# Altium schematic sheet Voltage Source.SchDoc: Voltage Source
size A4; Author: DODANHLUONG; Revision: 1.0; SheetNumber: 3; SheetTotal: 5; ProjectTitle: DSP_VERSION_1.0
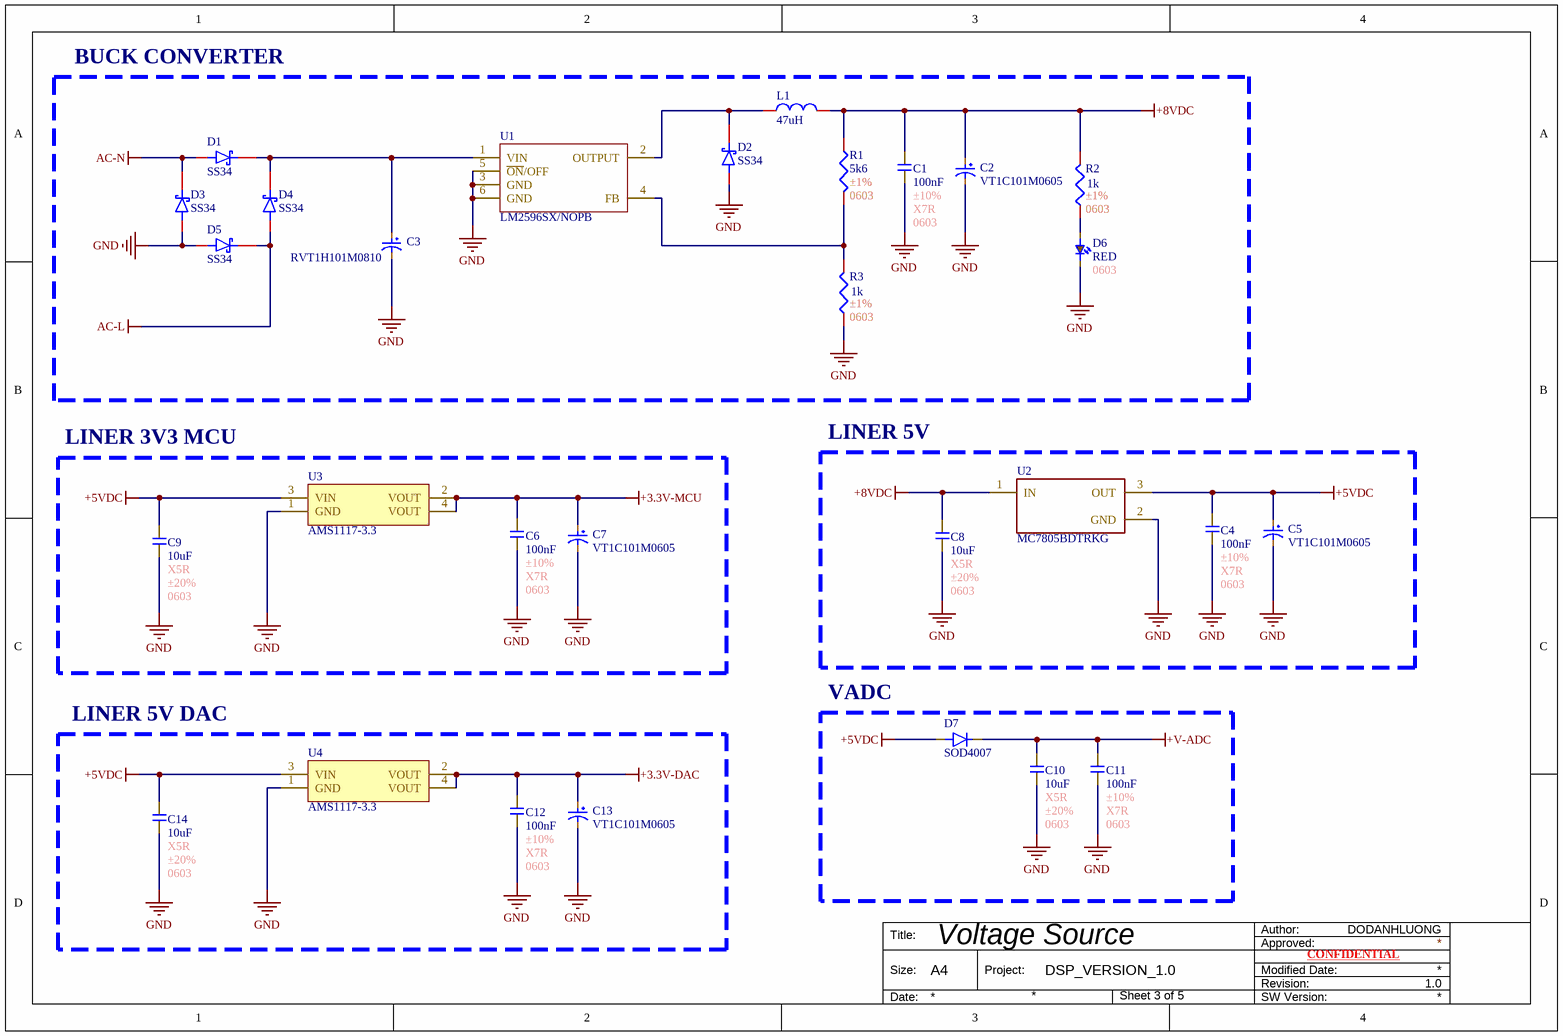
[diagram p0: Voltage Source.SchDoc]

## Parts
C1  100nF  Tolerance: ±10%  Temperature Coefficient: X7R  Package: 0603  [C0603]
C2  VT1C101M0605  [C_100uF_16V_Aluminum]
C3  RVT1H101M0810  [C_100uF_Aluminum]
C4  100nF  Tolerance: ±10%  Temperature Coefficient: X7R  Package: 0603  [C0603]
C5  VT1C101M0605  [C_100uF_16V_Aluminum]
C6  100nF  Tolerance: ±10%  Temperature Coefficient: X7R  Package: 0603  [C0603]
C7  VT1C101M0605  [C_100uF_16V_Aluminum]
C8  10uF  Temperature Coefficient: X5R  Tolerance: ±20%  Package: 0603  [C0603]
C9  10uF  Temperature Coefficient: X5R  Tolerance: ±20%  Package: 0603  [C0603]
C10  10uF  Temperature Coefficient: X5R  Tolerance: ±20%  Package: 0603  [C0603]
C11  100nF  Tolerance: ±10%  Temperature Coefficient: X7R  Package: 0603  [C0603]
C12  100nF  Tolerance: ±10%  Temperature Coefficient: X7R  Package: 0603  [C0603]
C13  VT1C101M0605  [C_100uF_16V_Aluminum]
C14  10uF  Temperature Coefficient: X5R  Tolerance: ±20%  Package: 0603  [C0603]
D1  SS34  [SS34]
D2  SS34  [SS34]
D3  SS34  [SS34]
D4  SS34  [SS34]
D5  SS34  [SS34]
D6  RED  Package: 0603  [LED0603]
D7  SOD4007  [SOD4007]
L1  47uH  [CD43]
R1  5k6  Tolerance: ±1%  Package: 0603  [R0603]
R2  1k  Tolerance: ±1%  Package: 0603  [R0603]
R3  1k  Tolerance: ±1%  Package: 0603  [R0603]
U1  LM2596SX/NOPB  [LM2596SX-5.0/NOPB]
U2  MC7805BDTRKG  [7805]
U3  AMS1117-3.3  [AMS1117-3.3]
U4  AMS1117-3.3  [AMS1117-3.3]

## Blocks framed on the sheet
BUCK CONVERTER: C1-C3 D1-D6 L1 R1-R3 U1
LINER 3V3 MCU: C6 C7 C9 U3
LINER 5V: C4 C5 C8 U2
LINER 5V DAC: C12-C14 U4
VADC: C10 C11 D7

## Nets
+3.3V-DAC: C12.2 C13.1 U4.2(VOUT) U4.4(VOUT)
+3.3V-MCU: C6.2 C7.1 U3.2(VOUT) U3.4(VOUT)
+5VDC: C4.2 C5.1 C9.2 C14.2 D7.2(A) U2.3(OUT) U3.3(VIN) U4.3(VIN)
+8VDC: C1.2 C2.1 C8.2 L1.2 R1.1 R2.2 U2.1(IN)
+V-ADC: C10.2 C11.2 D7.1(C)
AC-L: D4.2 D5.1
AC-N: D1.2 D3.1
GND: C1.1 C2.2 C3.2 C4.1 C5.2 C6.1 C7.2 C8.1 C9.1 C10.1 C11.1 C12.1 C13.2 C14.1 D2.2 D3.2 D5.2 D6.1 R3.1 U1.3(GND) U1.5(~{ON}/OFF) U1.6(GND) U2.2(GND) U3.1(GND) U4.1(GND)
NetC3_1: C3.1 D1.1 D4.1 U1.1(VIN)
NetD2_1: D2.1 L1.1 U1.2(OUTPUT)
NetD6_2: D6.2 R2.1
NetR1_2: R1.2 R3.2 U1.4(FB)

## Notes on the sheet
- Author:
- Title:
- Size:
- A4
- Project:
- Approved:
- Revision:
- Modified Date:
- CONFIDENTIAL
- Date:
- SW Version:

## Library data of the parts
C1 C4 C6 C11 C12 = C0603_100nF_±10%_X7R: 50V 100nF X7R ±10% 0603 Multilayer Ceramic Capacitors MLCC - SMD/SMT ROHS; Manufacturer: YAGEO; Mfr. Part #: CC0603KRX7R9BB104; LCSC Part #: C14663; Capacitance: 100nF; Link: https://www.lcsc.com/product-detail/C14663.html?s_z=n_capital%25200603%2520100nf
C2 C5 C7 C13 = C_100uF_16V_aluminum: 100uF 16V ±20% 63mA@120Hz SMD,D6.3xL5.4mm Aluminum Electrolytic Capacitors RoHS; Manufacturer: ROQANG; Key Attributes: CAP ALUM 100uF ±20% 16V SMD; Mfr. Part #: VT1C101M0605; LCSC Part #: C90273; Package: SMD,D6.3xL5.4mm; Link: https://www.lcsc.com/product-detail/C90273.html?s_z=n_capital%2520100uf%2520aluminum
C3 = C_100uF_aluminum: 100uF 50V ±20% 146mA@120Hz SMD,D8xL10.2mm Aluminum Electrolytic Capacitors RoHS; Manufacturer: ROQANG; Key Attributes: CAP ALUM 100uF ±20% 50V SMD; Mfr. Part #: RVT1H101M0810; LCSC Part #: C72480; Package: SMD,D8xL10.2mm; Link: https://www.lcsc.com/product-detail/C72480.html?s_z=n_capital%2520100uf%2520aluminum
C8-C10 C14 = C0603_10uF_±10%_X7R: 25V 10uF X5R ±20% 0603 Multilayer Ceramic Capacitors MLCC - SMD/SMT ROHS; Manufacturer: YAGEO; Mfr. Part #: CC0603MRX5R8BB106; LCSC Part #: C596327; Capacitance: 10uF; Link: https://www.lcsc.com/product-detail/C596327.html?s_z=n_capital%25200603%252010uF%2520yageo
D1-D5 = SS34: 40V Independent 3A 550mV@3A SMA(DO-214AC) Schottky Diodes ROHS; Manufacturer: MDD(Microdiode Semiconductor); Mfr. Part #: SS34; LCSC Part #: C8678; Package: SMA(DO-214AC); Voltage - DC Reverse(Vr): 40V; Current - Rectified: 3A; Link: https://www.lcsc.com/product-detail/C8678.html?s_z=n_SS34
D6 = D0603_RED: 25mcd~40mcd Water Clear -40℃~+85℃ 624nm Red 120° 60mW 0402 LED Indication - Discrete ROHS; Manufacturer: XINGLIGHT; Mfr. Part #: XL-1005UGC; Voltage - Forward(Vf): 3V; LCSC Part #: C965793; Power(Watts): 60mW; Link: https://www.lcsc.com/product-detail/C136765.html?s_z=n_LED%25200402%2520RED; Illumination Color: RED
D7 = SOD4007: 1A Independent 1kV 1.1V@1A SOD-123FL Diodes - General Purpose ROHS; Manufacturer: MDD(Microdiode Semiconductor); Mfr. Part #: SOD4007; Package: SOD-123FL; LCSC Part #: C18124; Link: https://www.lcsc.com/product-detail/C18124.html?s_z=n_SOD4007; Voltage - DC Reverse(Vr): 1kV; Current - Rectified: 1A
L1 = CD4-10UH: 1.15A 10uH Unshielded Inductor ±20% SMD,4x4.5mm Power Inductors ROHS; Manufacturer: ZE; Mfr. Part #: CD43-100M; Key Attributes: FIXED IND 10uH 1.15A 182mΩ SMD,4x4.5mm; DC Resistance(DCR): 182mΩ; LCSC Part #: C18734467; Package: SMD,4x4.5mm; Link: https://www.lcsc.com/product-detail/C18734467.html?s_z=n_CD43%252010uH; Tolerance: ±20%; Current Rating: 1.15A; Inductance: 10uH
R1-R3 = R0603_4k7Ω_±1%: 62.5mW Thick Film Resistor 50V ±1% ±200ppm/℃ 10Ω 0402 Chip Resistor - Surface Mount ROHS; Manufacturer: YAGEO; Mfr. Part #: RC0402FR-0710RL; Resistance: 4k7Ω; LCSC Part #: C138066; Link: https://www.lcsc.com/product-detail/C138066.html?s_z=n_resistor%25200402%252010R
U1 = LM2596SX/NOPB: 150kHz Buck Fixed 1 TO-263-5 Voltage Regulators - DC DC Switching Regulators RoHS; Manufacturer: TI; Key Attributes: LM2596 SIMPLE SWITCHER 3A Step-Down Voltage Regulator; Mfr. Part #: LM2596SX/NOPB; LCSC Part #: C10002; Package: TO-263-5; Link: https://www.lcsc.com/product-detail/C10002.html?s_z=n_lm2596
U2 = 7805: 68dB@(120Hz) 1A Fixed 5V Positive 24V TO-252-2(DPAK) Voltage Regulators - Linear, Low Drop Out (LDO) Regulators ROHS; Manufacturer: onsemi; Mfr. Part #: MC7805BDTRKG; LCSC Part #: C110908; Package: TO-252-2(DPAK); Output Current: 1A; Output Voltage: 5V; Voltage - Supply: 24V; Link: https://www.lcsc.com/product-detail/C110908.html?s_z=n_7805
U3 U4 = AMS1117-3.3: 72dB@(120Hz) 1A Fixed 3.3V Positive 16V SOT-223 Voltage Regulators - Linear, Low Drop Out (LDO) Regulators ROHS; Manufacturer: Advanced Monolithic Systems; LCSC Part #: C6186; Link: https://www.lcsc.com/product-detail/C6186.html?s_z=n_ams1117-3.3; Output Current: 1A; Package: SOT-223; Mfr. Part #: AMS1117-3.3